# Altium project PM12_CFD.PrjPcb (part 1 of 2)
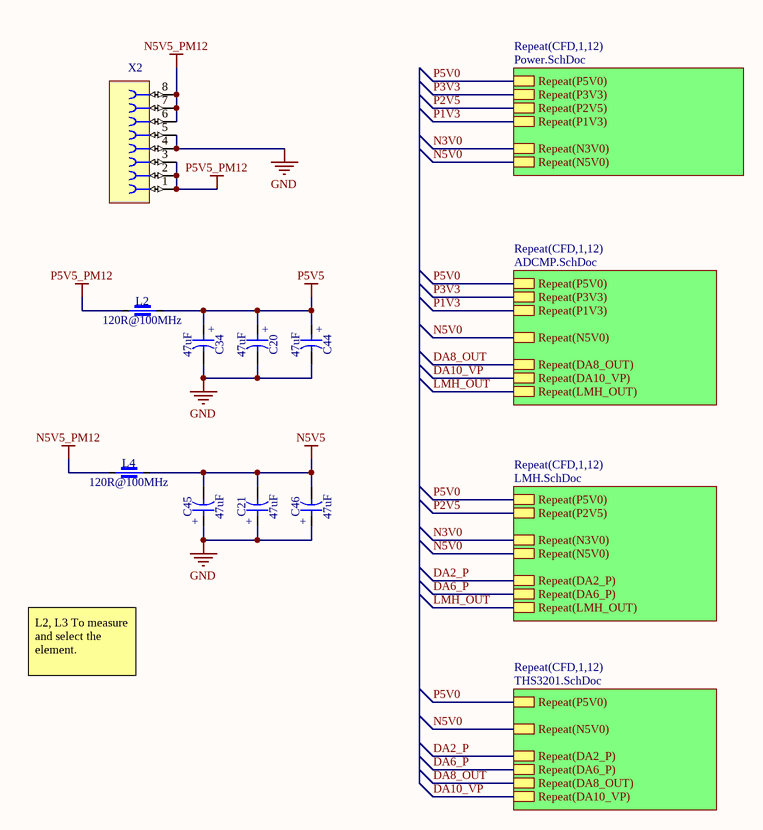
[diagram p0: PM12_CFD_Main.SchDoc]
5 sheets, 1413 parts. Net scope: hierarchical (ports join the sheet entries above them; power ports are global).
Board file: PM12_CFD.PcbDoc
Sheets:
  PM12_CFD_Main.SchDoc
    CFD1 = Power.SchDoc
    CFD2 = Power.SchDoc
    CFD3 = Power.SchDoc
    CFD4 = Power.SchDoc
    CFD5 = Power.SchDoc
    CFD6 = Power.SchDoc
    CFD7 = Power.SchDoc
    CFD8 = Power.SchDoc
    CFD9 = Power.SchDoc
    CFD10 = Power.SchDoc
    CFD11 = Power.SchDoc
    CFD12 = Power.SchDoc
    CFD1 = LMH.SchDoc
    CFD2 = LMH.SchDoc
    CFD3 = LMH.SchDoc
    CFD4 = LMH.SchDoc
    CFD5 = LMH.SchDoc
    CFD6 = LMH.SchDoc
    CFD7 = LMH.SchDoc
    CFD8 = LMH.SchDoc
    CFD9 = LMH.SchDoc
    CFD10 = LMH.SchDoc
    CFD11 = LMH.SchDoc
    CFD12 = LMH.SchDoc
    CFD1 = THS3201.SchDoc
    CFD2 = THS3201.SchDoc
    CFD3 = THS3201.SchDoc
    CFD4 = THS3201.SchDoc
    CFD5 = THS3201.SchDoc
    CFD6 = THS3201.SchDoc
    CFD7 = THS3201.SchDoc
    CFD8 = THS3201.SchDoc
    CFD9 = THS3201.SchDoc
    CFD10 = THS3201.SchDoc
    CFD11 = THS3201.SchDoc
    CFD12 = THS3201.SchDoc
    CFD1 = ADCMP.SchDoc
    CFD2 = ADCMP.SchDoc
    CFD3 = ADCMP.SchDoc
    CFD4 = ADCMP.SchDoc
    CFD5 = ADCMP.SchDoc
    CFD6 = ADCMP.SchDoc
    CFD7 = ADCMP.SchDoc
    CFD8 = ADCMP.SchDoc
    CFD9 = ADCMP.SchDoc
    CFD10 = ADCMP.SchDoc
    CFD11 = ADCMP.SchDoc
    CFD12 = ADCMP.SchDoc

## Sheet PM12_CFD_Main.SchDoc
size A4; SheetNumber: 1; SheetTotal: 5

### Parts
C20  47uF  [CAPAE530X610N]
C21  47uF  [CAPAE530X610N]
C34  47uF  [CAPAE530X610N]
C44  47uF  [CAPAE530X610N]
C45  47uF  [CAPAE530X610N]
C46  47uF  [CAPAE530X610N]
L2  120R@100MHz  [IND_MURATA_BLM31KN]
L4  120R@100MHz  [IND_MURATA_BLM31KN]
X2  Socket 8  [SAMTEC_CES-108-01-T-S]  (value not drawn)

### Sub-sheets
Repeat(CFD,1,12) = Power.SchDoc: Repeat(P5V0), Repeat(P3V3), Repeat(P2V5), Repeat(P1V3), Repeat(N3V0), Repeat(N5V0)
Repeat(CFD,1,12) = LMH.SchDoc: Repeat(LMH_OUT), Repeat(DA2_P), Repeat(DA6_P), Repeat(P5V0), Repeat(P2V5), Repeat(N5V0), Repeat(N3V0)
Repeat(CFD,1,12) = THS3201.SchDoc: Repeat(DA2_P), Repeat(DA6_P), Repeat(DA10_VP), Repeat(P5V0), Repeat(N5V0), Repeat(DA8_OUT)
Repeat(CFD,1,12) = ADCMP.SchDoc: Repeat(LMH_OUT), Repeat(DA10_VP), Repeat(P5V0), Repeat(P3V3), Repeat(P1V3), Repeat(N5V0), Repeat(DA8_OUT)

### Nets
GND: C20.2 C21.1 C34.2 C44.2 C45.1 C46.1 X2.4 X2.5
N5V5: C21.2 C45.2 C46.2 L4.2
N5V5_PM12: L4.1 X2.6 X2.7 X2.8
P5V5: C20.1 C34.1 C44.1 L2.2
P5V5_PM12: L2.1 X2.1 X2.2 X2.3
DA2_P: sheet Repeat(CFD,1,12)/Repeat(DA2_P), sheet Repeat(CFD,1,12)/Repeat(DA2_P)
DA6_P: sheet Repeat(CFD,1,12)/Repeat(DA6_P), sheet Repeat(CFD,1,12)/Repeat(DA6_P)
DA8_OUT: sheet Repeat(CFD,1,12)/Repeat(DA8_OUT), sheet Repeat(CFD,1,12)/Repeat(DA8_OUT)
DA10_VP: sheet Repeat(CFD,1,12)/Repeat(DA10_VP), sheet Repeat(CFD,1,12)/Repeat(DA10_VP)
LMH_OUT: sheet Repeat(CFD,1,12)/Repeat(LMH_OUT), sheet Repeat(CFD,1,12)/Repeat(LMH_OUT)
N3V0: sheet Repeat(CFD,1,12)/Repeat(N3V0), sheet Repeat(CFD,1,12)/Repeat(N3V0)
N5V0: sheet Repeat(CFD,1,12)/Repeat(N5V0), sheet Repeat(CFD,1,12)/Repeat(N5V0), sheet Repeat(CFD,1,12)/Repeat(N5V0), sheet Repeat(CFD,1,12)/Repeat(N5V0)
P1V3: sheet Repeat(CFD,1,12)/Repeat(P1V3), sheet Repeat(CFD,1,12)/Repeat(P1V3)
P2V5: sheet Repeat(CFD,1,12)/Repeat(P2V5), sheet Repeat(CFD,1,12)/Repeat(P2V5)
P3V3: sheet Repeat(CFD,1,12)/Repeat(P3V3), sheet Repeat(CFD,1,12)/Repeat(P3V3)
P5V0: sheet Repeat(CFD,1,12)/Repeat(P5V0), sheet Repeat(CFD,1,12)/Repeat(P5V0), sheet Repeat(CFD,1,12)/Repeat(P5V0), sheet Repeat(CFD,1,12)/Repeat(P5V0)

### Notes on the sheet
- L2, L3 To measure and select the element.
- (in symbol CAE530-610_47UF_16V_20%) +

### Library data of the parts
C20 C21 C34 C44-C46 = CAE530-610_47UF_16V_20%: Polarised capacitor; Part Description: Conductive Polymer Hybrid Aluminum Electrolytic Capacitor; Manufacturer: CHEMI-CON; Manufacturer Part Number: HHXD160ARA470ME61G; Voltage: 16V; Tolerance: ±20%; Part Number: CAE530-610_47UF_16V_20%; Component Kind: Standard; Component Type: Standard; Pin Count: 2; Value: 47uF; Status: Not Recommended; Case: C; Mounted: Yes; Socket: No; SMD: Yes; Sense: No; ComponentHeight: 6.1mm; HelpURL: \\cern.ch\dfs\Applications\Altium\Datasheets\CAE_CHIMI-CON_HXD.pdf; Author: CERN DEM HF; CreateDate: 15.04.2024; LatestRevisionDate: 15.04.2024
L2 L4 = IND1206_MURATA_BLM31KN121SN1: Part Description: SMD Chip Ferrite Bead, BLM31KN_SN Series; Manufacturer: MURATA; Power: 6A; Resistance: 0.009R; Tolerance: ±25%; Part Number: IND1206_MURATA_BLM31KN121SN1; Component Kind: Standard; Component Type: Standard; Footprint: IND_MURATA_BLM31KN1; Pin Count: 2; Value: 120R@100MHz; Manufacturer Part Number: BLM31KN121SN1; Case: 1206; Mounted: Yes; Socket: No; SMD: Yes; Sense: No; ComponentHeight: 1.8mm; HelpURL: \\cern.ch\dfs\Applications\Altium\Datasheets\IND1206_MURATA_ BLM31KN_SN.pdf; Author: CERN DEM HF; CreateDate: 05.01.2022; LatestRevisionDate: 05.01.2022
X2 = SAMTEC_CES-108-01-L-S: Connector 8 Female; Part Description: 8 Contacts, Pitch 2.54mm, Single Row Through Mount Straight Socket (Lead Length 3.25mm); Manufacturer: SAMTEC; PressFit: No; Part Number: SAMTEC_CES-108-01-L-S; Component Kind: Standard; Component Type: Standard; Pin Count: 8; Family: Socket 8; Mounted: Yes; Socket: No; SMD: No; Sense: No; Status: None; Manufacturer Part Number: CES-108-01-L-S; ComponentHeight: 5.08mm; HelpURL: \\cern.ch\dfs\Applications\Altium\Datasheets\SAMTEC_CES-108-01-T-S.pdf; Author: CERN DEM HF; CreateDate: 25.04.2024; LatestRevisionDate: 25.04.2024

## Sheet Power.SchDoc
size A4; SheetNumber: 2; SheetTotal: 5
Used 12 times, as channels CFD1, CFD2, CFD3, CFD4, CFD5, CFD6, CFD7, CFD8, CFD9, CFD10, CFD11, CFD12. Parts and nets are listed once, with the designators drawn on the sheet.
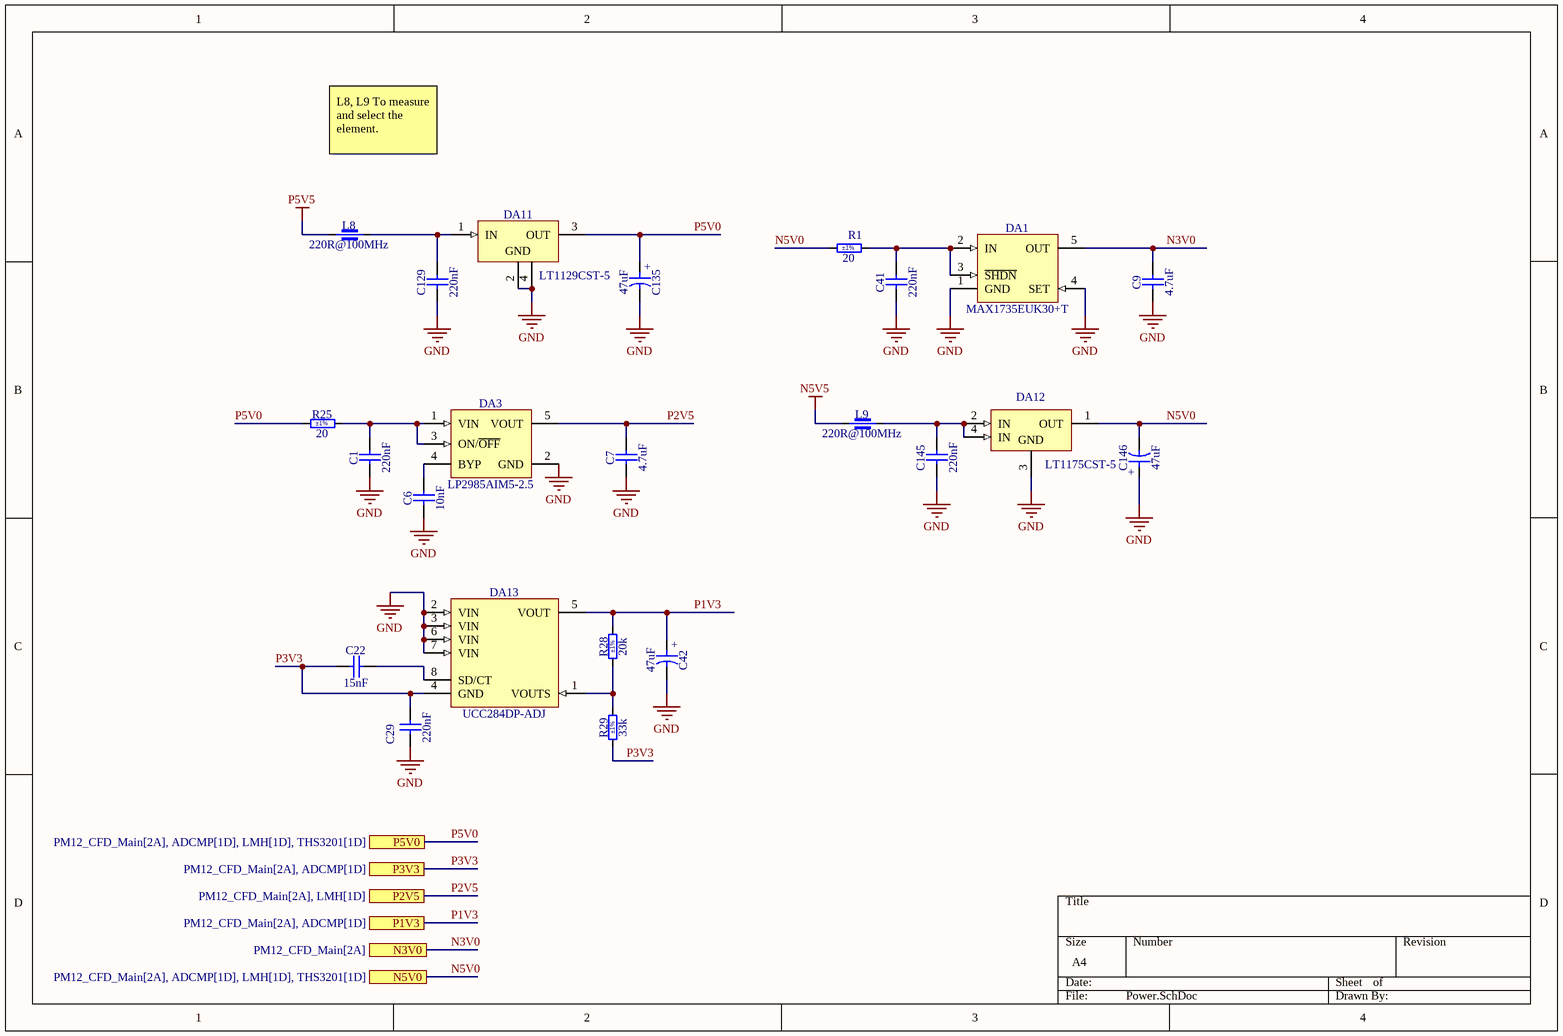
[diagram p1: Power.SchDoc]

### Parts
C1  220nF  [CAPC2012X135N]
C6  10nF  [CAPC2012X135N]
C7  4.7uF  [CAPC2012X135N]
C9  4.7uF  [CAPC2012X135N]
C22  15nF  [CAPC2012X135N]
C29  220nF  [CAPC2012X135N]
C41  220nF  [CAPC2012X135N]
C42  47uF  [CAPAE530X610N]
C129  220nF  [CAPC2012X135N]
C135  47uF  [CAPAE530X610N]
C145  220nF  [CAPC2012X135N]
C146  47uF  [CAPAE530X610N]
DA1  MAX1735EUK30+T  [SOT95P280X145-5N]
DA3  LP2985AIM5-2.5  [SOT95P280X145-5N]
DA11  LT1129CST-5  [SOT230P700X180-4N]
DA12  LT1175CST-5  [SOT230P700X180-4N]
DA13  UCC284DP-ADJ  [SOIC127P600X175-8N]
L8  220R@100MHz  [INDC2012X105N]
L9  220R@100MHz  [INDC2012X105N]
R1  20  Tolerance: ±1%  [RESC2012X60N]
R25  20  Tolerance: ±1%  [RESC2012X60N]
R28  20k  Tolerance: ±1%  [RESC2012X60N]
R29  33k  Tolerance: ±1%  [RESC2012X60N]

### Ports
N3V0 (see PM12_CFD_Main[2A]), N5V0 (see PM12_CFD_Main[2A], ADCMP[1D], LMH[1D], THS3201[1D]), P1V3 (see PM12_CFD_Main[2A], ADCMP[1D]), P2V5 (see PM12_CFD_Main[2A], LMH[1D]), P3V3 (see PM12_CFD_Main[2A], ADCMP[1D]), P5V0 (see PM12_CFD_Main[2A], ADCMP[1D], LMH[1D], THS3201[1D])

### Nets
GND: C1.1 C6.1 C7.1 C9.1 C29.1 C41.1 C42.2 C129.1 C135.2 C145.1 C146.1 DA1.1(GND) DA1.4(SET) DA3.2(GND) DA11.2(GND) DA11.4(GND) DA12.3(GND) DA13.2(VIN) DA13.3(VIN) DA13.6(VIN) DA13.7(VIN)
N5V5: L9.1
P5V5: L8.1
N3V0: C9.2 DA1.5(OUT) ; port N3V0
N5V0: C146.2 DA12.1(OUT) R1.1 ; port N5V0
P1V3: C42.1 DA13.5(VOUT) R28.2 ; port P1V3
P2V5: C7.2 DA3.5(VOUT) ; port P2V5
P3V3: C22.1 C29.2 DA13.4(GND) R29.1 ; port P3V3
P5V0: C135.1 DA11.3(OUT) R25.1 ; port P5V0
NetC1_2: C1.2 DA3.1(VIN) DA3.3(ON/~{OFF}) R25.2
NetC6_2: C6.2 DA3.4(BYP)
NetC22_2: C22.2 DA13.8(SD/CT)
NetC41_2: C41.2 DA1.2(IN) DA1.3(~{SHDN}) R1.2
NetC129_2: C129.2 DA11.1(IN) L8.2
NetC145_2: C145.2 DA12.2(IN) DA12.4(IN) L9.2
NetDA13_1: DA13.1(VOUTS) R28.1 R29.2

### Channels
CFD1: designators end in _CFD1; ports N3V0=N3V0 N5V0=N5V0 P1V3=P1V3 P2V5=P2V5 P3V3=P3V3 P5V0=P5V0
CFD2: designators end in _CFD2; ports N3V0=N3V0 N5V0=N5V0 P1V3=P1V3 P2V5=P2V5 P3V3=P3V3 P5V0=P5V0
CFD3: designators end in _CFD3; ports N3V0=N3V0 N5V0=N5V0 P1V3=P1V3 P2V5=P2V5 P3V3=P3V3 P5V0=P5V0
CFD4: designators end in _CFD4; ports N3V0=N3V0 N5V0=N5V0 P1V3=P1V3 P2V5=P2V5 P3V3=P3V3 P5V0=P5V0
CFD5: designators end in _CFD5; ports N3V0=N3V0 N5V0=N5V0 P1V3=P1V3 P2V5=P2V5 P3V3=P3V3 P5V0=P5V0
CFD6: designators end in _CFD6; ports N3V0=N3V0 N5V0=N5V0 P1V3=P1V3 P2V5=P2V5 P3V3=P3V3 P5V0=P5V0
CFD7: designators end in _CFD7; ports N3V0=N3V0 N5V0=N5V0 P1V3=P1V3 P2V5=P2V5 P3V3=P3V3 P5V0=P5V0
CFD8: designators end in _CFD8; ports N3V0=N3V0 N5V0=N5V0 P1V3=P1V3 P2V5=P2V5 P3V3=P3V3 P5V0=P5V0
CFD9: designators end in _CFD9; ports N3V0=N3V0 N5V0=N5V0 P1V3=P1V3 P2V5=P2V5 P3V3=P3V3 P5V0=P5V0
CFD10: designators end in _CFD10; ports N3V0=N3V0 N5V0=N5V0 P1V3=P1V3 P2V5=P2V5 P3V3=P3V3 P5V0=P5V0
CFD11: designators end in _CFD11; ports N3V0=N3V0 N5V0=N5V0 P1V3=P1V3 P2V5=P2V5 P3V3=P3V3 P5V0=P5V0
CFD12: designators end in _CFD12; ports N3V0=N3V0 N5V0=N5V0 P1V3=P1V3 P2V5=P2V5 P3V3=P3V3 P5V0=P5V0

### Notes on the sheet
- L8, L9 To measure and select the element.
- (in symbol CAE530-610_47UF_16V_20%) +

### Library data of the parts
C1 C29 C41 C129 C145 = CC0805_220NF_50V_10%_X7R: Non-polarised capacitor; Part Description: SMD Multilayer Chip Ceramic Capacitor; Manufacturer: GENERIC; Manufacturer1 Part Number: GRM21BR71H224KA01L; Voltage: 50V; TC: X7R; Tolerance: ±10%; Part Number: CC0805_220NF_50V_10%_X7R; Component Kind: Standard; Component Type: Standard; Pin Count: 2; Value: 220nF; Status: Preferred; Manufacturer Part Number: CC0805_220NF_50V_10%_X7R; Case: 0805; Mounted: Yes; Socket: No; SMD: Yes; Sense: No; Manufacturer1 Example: MURATA; Manufacturer1 ComponentHeight: 1.35mm; HelpURL: \\cern.ch\dfs\Applications\Altium\Datasheets\CC0805_X7R_MURATA.pdf; Author: CERN DEM JLC; CreateDate: 03.12.2007; LatestRevisionDate: 03.12.2007
C6 = CC0805_10NF_50V_5%_C0G: Non-polarised capacitor; Part Description: SMD Multilayer Chip Ceramic Capacitor; Manufacturer: GENERIC; Manufacturer1 Part Number: C0805C103J5GACTU; Voltage: 50V; TC: C0G/NP0; Tolerance: ±5%; Part Number: CC0805_10NF_50V_5%_C0G; Component Kind: Standard; Component Type: Standard; Pin Count: 2; Value: 10nF; Status: None; Manufacturer Part Number: CC0805_10NF_50V_5%_C0G; Case: 0805; Mounted: Yes; Socket: No; SMD: Yes; Sense: No; Manufacturer1 Example: KEMET; Manufacturer1 ComponentHeight: 0.88mm; HelpURL: \\cern.ch\dfs\Applications\Altium\Datasheets\CC0805_C0G_KEMET_(Commercial Grade).pdf; Author: CERN DEM JLC; CreateDate: 02.02.2011; LatestRevisionDate: 22.04.2015
C7 C9 = CC0805_4.7UF_16V_10%_X7R: Non-polarised capacitor; Part Description: SMD Multilayer Chip Ceramic Capacitor; Manufacturer: GENERIC; Manufacturer1 Part Number: EMK212B7475KG-T; Voltage: 16V; TC: X7R; Tolerance: ±10%; Part Number: CC0805_4.7UF_16V_10%_X7R; Component Kind: Standard; Component Type: Standard; Pin Count: 2; Value: 4.7uF; Status: Preferred; Manufacturer Part Number: CC0805_4.7UF_16V_10%_X7R; Case: 0805; Mounted: Yes; Socket: No; SMD: Yes; Sense: No; Manufacturer1 Example: TAIYO YUDEN; Manufacturer1 ComponentHeight: 1.35mm; HelpURL: \\cern.ch\dfs\Applications\Altium\Datasheets\CC0805_X7R_TAIYO-YUDEN_HIGH-VALUE.pdf; Author: CERN DEM JLC; CreateDate: 16.09.2014; LatestRevisionDate: 16.09.2014
C22 = CC0805_15NF_50V_10%_X7R: Non-polarised capacitor; Part Description: SMD Multilayer Chip Ceramic Capacitor; Manufacturer: GENERIC; Manufacturer1 Part Number: 223858615638; Voltage: 50V; TC: X7R; Tolerance: ±10%; Part Number: CC0805_15NF_50V_10%_X7R; Component Kind: Standard; Component Type: Standard; Pin Count: 2; Value: 15nF; Status: Preferred; Manufacturer Part Number: CC0805_15NF_50V_10%_X7R; Case: 0805; Mounted: Yes; Socket: No; SMD: Yes; Sense: No; Manufacturer1 Example: PHYCOMP; Manufacturer1 ComponentHeight: 1.35mm; HelpURL: \\cern.ch\dfs\Applications\Altium\Datasheets\CC0805_X7R_PHYCOMP.pdf; Author: CERN DEM JLC; CreateDate: 03.12.2007; LatestRevisionDate: 03.12.2007
C42 C135 C146 = CAE530-610_47UF_16V_20%: as C20 on sheet PM12_CFD_Main; Part Number: CAE530-610_47UF_16V_20%; Component Kind: Standard; Component Type: Standard; Pin Count: 2; Value: 47uF; Status: Not Recommended; Case: C; Mounted: Yes; Socket: No; SMD: Yes; Sense: No; ComponentHeight: 6.1mm; HelpURL: \\cern.ch\dfs\Applications\Altium\Datasheets\CAE_CHIMI-CON_HXD.pdf; Author: CERN DEM HF; CreateDate: 15.04.2024; LatestRevisionDate: 15.04.2024
DA1 = MAX1735EUK30+T: 200mA, Negative-Output, Low-Dropout Linear Regulator; Part Description: 3V, 200mA, Negative-Output, Low-Dropout Linear Regulator; Manufacturer: MAXIM; PressFit: No; Bonding: No; Part Number: MAX1735EUK30+T; Component Kind: Standard; Component Type: Standard; Device: MAX1735EUK30+T; PackageDescription: SOT23, 0.95mm Pitch; 5 Pin, 1.60mm W X 2.90mm L X 1.45mm H body, IPC Medium Density; Manufacturer Part Number: MAX1735EUK30; Pin Count: 5; Case: SOT23-5; Mounted: Yes; Socket: No; SMD: Yes; Sense: No; ComponentHeight: 1.45mm; HelpURL: \\cern.ch\dfs\Applications\Altium\Datasheets\MAX1735EUK30+T.pdf; Author: CERN DEM JLC; CreateDate: 17.02.2010; LatestRevisionDate: 04.04.2022
DA3 = LP2985AIM5-2.5: 150mA Low-Noise Low-Dropout Regulator Whit Shutdown; Part Description: 2.5V, 150mA Low-Noise Low-Dropout Regulator Whit Shutdown; Manufacturer: TEXAS INSTRUMENTS; PressFit: No; Bonding: No; Part Number: LP2985AIM5-2.5; Component Kind: Standard; Component Type: Standard; Device: LP2985AIM5-2.5; PackageDescription: SOT23, 0.95mm Pitch; 5 Pin, 1.60mm W X 2.90mm L X 1.45mm H body, IPC Medium Density; Manufacturer Part Number: LP2985AIM5-2.5; Pin Count: 5; Case: SOT23-5; Mounted: Yes; Socket: No; SMD: Yes; Sense: No; ComponentHeight: 1.45mm; HelpURL: \\cern.ch\dfs\Applications\Altium\Datasheets\LP2985AIM5.pdf; Author: CERN DEM HF; CreateDate: 16.04.2024; LatestRevisionDate: 16.04.2024
DA11 = LT1129CST-5: 3-Terminal Regulator 1=IN 2=GND 3=OUT 4=GND; Part Description: 5V, 700mA Micropower Low Dropout Regulator with Shutdown; Manufacturer: LINEAR TECHNOLOGY; PressFit: No; Bonding: No; Part Number: LT1129CST-5; Component Kind: Standard; Component Type: Standard; Device: LT1129CST-5; PackageDescription: SOT223, 2.30mm Pitch; 4 Pin, 3.70mm W X 6.70mm L X 1.80mm H body, IPC Medium Density; Manufacturer Part Number: LT1129CST-5; Pin Count: 4; Case: SOT223; Mounted: Yes; Socket: No; SMD: Yes; Sense: No; ComponentHeight: 1.8mm; HelpURL: \\cern.ch\dfs\Applications\Altium\Datasheets\LT1129.pdf; Author: CERN DEM HF; CreateDate: 16.04.2024; LatestRevisionDate: 16.04.2024
DA12 = LT1175CST-5: 3-Terminal Regulator 1=OUT 2=IN 3=GND 4=IN; Part Description: 5V 500mA Negative Low Dropout Micropower Regulator; Manufacturer: LINEAR TECHNOLOGY; PressFit: No; Bonding: No; Part Number: LT1175CST-5; Component Kind: Standard; Component Type: Standard; Device: LT1175CST-5; PackageDescription: SOT223, 2.30mm Pitch; 4 Pin, 3.70mm W X 6.70mm L X 1.80mm H body, IPC Medium Density; Manufacturer Part Number: LT1175CST-5; Pin Count: 4; Case: SOT223; Mounted: Yes; Socket: No; SMD: Yes; Sense: No; ComponentHeight: 1.8mm; HelpURL: \\cern.ch\dfs\Applications\Altium\Datasheets\LT1175.pdf; Author: CERN DEM HF; CreateDate: 16.04.2024; LatestRevisionDate: 16.04.2024
DA13 = UCC284DP-ADJ: 5V, 500mA Low-Dropout Negative Linear Regulator; Part Description: 5V, 500mA Low-Dropout Negative Linear Regulator, Adjustable Output; Manufacturer: TEXAS INSTRUMENTS; PressFit: No; Bonding: No; Part Number: UCC284DP-ADJ; Component Kind: Standard; Component Type: Standard; Device: UCC284DP-ADJ; PackageDescription: SOIC 8, Pitch 1.27mm, Body 4x5mm, IPC Medium Density; Manufacturer Part Number: UCC284DP-ADJ; Pin Count: 8; Case: SOIC8; Mounted: Yes; Socket: No; SMD: Yes; Sense: No; ComponentHeight: 1.75mm; HelpURL: \\cern.ch\dfs\Applications\Altium\Datasheets\UCC284DP-ADJ.pdf; Author: CERN DEM BR; CreateDate: 20.06.2019; LatestRevisionDate: 20.06.2019
L8 L9 = IND0805_TDK_MPZ2012S221A: Part Description: SMT Chip Bead for General Power Line (MPZ Series); Manufacturer: TDK; Power: 3A; Resistance: 0.04R; Tolerance: ±25%; Part Number: IND0805_TDK_MPZ2012S221A; Component Kind: Standard; Component Type: Standard; Pin Count: 2; Value: 220R@100MHz; Manufacturer Part Number: MPZ2012S221A; Case: 0805; Mounted: Yes; Socket: No; SMD: Yes; Sense: No; ComponentHeight: 1.05mm; HelpURL: \\cern.ch\dfs\Applications\Altium\Datasheets\IND0805_TDK_MPZ2012.pdf; Author: CERN DEM HF; CreateDate: 04.10.2021; LatestRevisionDate: 04.10.2021
R1 R25 = R0805_20R_1%_0.125W_100PPM: Resistor - 1%; Part Description: General Purpose Thick Film Chip Resistor; Manufacturer: GENERIC; Manufacturer1 Part Number: NRC10F20R0TRF; Power: 0.125W; TC: ±100ppm/°C; PressFit: No; Part Number: R0805_20R_1%_0.125W_100PPM; Component Kind: Standard; Component Type: Standard; Pin Count: 2; Value: 20; Status: Preferred; Manufacturer Part Number: R0805_20R_1%_0.125W_100PPM; Case: 0805; Mounted: Yes; Sense: No; Socket: No; SMD: Yes; Manufacturer1 Example: NIC COMPONENT; Manufacturer1 ComponentHeight: 0.6mm; HelpURL: \\cern.ch\dfs\Applications\Altium\Datasheets\R0805_NIC_NRC.pdf; Author: CERN DEM JLC; CreateDate: 03.12.2007; LatestRevisionDate: 13.03.2008
R28 = R0805_20K_1%_0.125W_100PPM: Resistor - 1%; Part Description: General Purpose Thick Film Chip Resistor; Manufacturer: GENERIC; Manufacturer1 Part Number: NRC10F2002TRF; Power: 0.125W; TC: ±100ppm/°C; PressFit: No; Part Number: R0805_20K_1%_0.125W_100PPM; Component Kind: Standard; Component Type: Standard; Pin Count: 2; Value: 20k; Status: Preferred; Manufacturer Part Number: R0805_20K_1%_0.125W_100PPM; Case: 0805; Mounted: Yes; Sense: No; Socket: No; SMD: Yes; Manufacturer1 Example: NIC COMPONENT; Manufacturer1 ComponentHeight: 0.6mm; HelpURL: \\cern.ch\dfs\Applications\Altium\Datasheets\R0805_NIC_NRC.pdf; Author: CERN DEM JLC; CreateDate: 03.12.2007; LatestRevisionDate: 13.03.2008
R29 = R0805_33K_1%_0.125W_100PPM: Resistor - 1%; Part Description: General Purpose Thick Film Chip Resistor; Manufacturer: GENERIC; Manufacturer1 Part Number: NRC10F3302TRF; Power: 0.125W; TC: ±100ppm/°C; PressFit: No; Part Number: R0805_33K_1%_0.125W_100PPM; Component Kind: Standard; Component Type: Standard; Pin Count: 2; Value: 33k; Status: Preferred; Manufacturer Part Number: R0805_33K_1%_0.125W_100PPM; Case: 0805; Mounted: Yes; Sense: No; Socket: No; SMD: Yes; Manufacturer1 Example: NIC COMPONENT; Manufacturer1 ComponentHeight: 0.6mm; HelpURL: \\cern.ch\dfs\Applications\Altium\Datasheets\R0805_NIC_NRC.pdf; Author: CERN DEM JLC; CreateDate: 03.12.2007; LatestRevisionDate: 13.03.2008

## Sheet LMH.SchDoc
size A4; SheetNumber: 3; SheetTotal: 5
Used 12 times, as channels CFD1, CFD2, CFD3, CFD4, CFD5, CFD6, CFD7, CFD8, CFD9, CFD10, CFD11, CFD12. Parts and nets are listed once, with the designators drawn on the sheet.
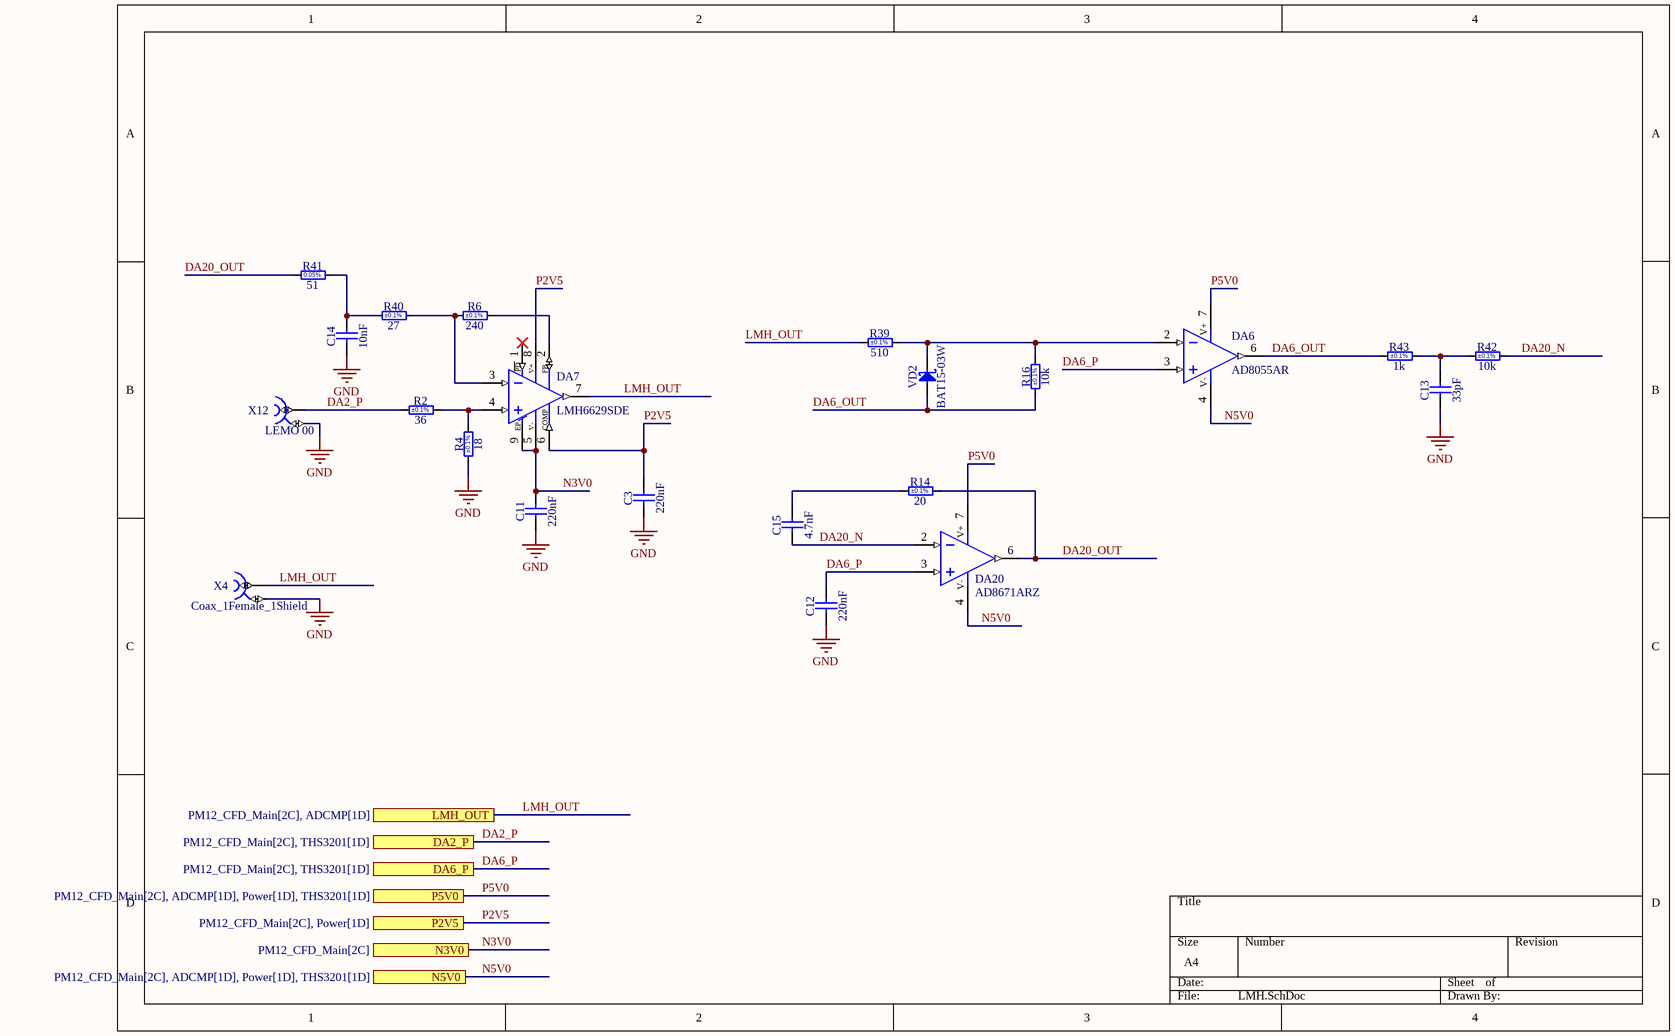
[diagram p2: LMH.SchDoc]

### Parts
C3  220nF  [CAPC2012X135N]
C11  220nF  [CAPC2012X135N]
C12  220nF  [CAPC2012X135N]
C13  33pF  [CAPC2013X115N]
C14  10nF  [CAPC2012X135N]
C15  4.7nF  [CAPC2012X135N]
DA6  AD8055AR  [SOIC127P600X175-8N]
DA7  LMH6629SDE  [TEXAS_NGQ0008A]
DA20  AD8671ARZ  [SOIC127P600X175-8N]
R2  36  Tolerance: ±0.1%  [RESC1608X64N]
R4  18  Tolerance: ±0.1%  [RESC1608X64N]
R6  240  Tolerance: ±0.1%  [RESC1005X40N]
R14  20  Tolerance: ±0.1%  [RESC2012X60N]
R16  10k  Tolerance: ±0.1%  [RESC2012X60N]
R39  510  Tolerance: ±0.1%  [RESC1005X40N]
R40  27  Tolerance: ±0.1%  [RESC1608X64N]
R41  51  [RESC2012X60N]
R42  10k  Tolerance: ±0.1%  [RESC2012X60N]
R43  1k  Tolerance: ±0.1%  [RESC2012X60N]
VD2  BAT15-03W  [SOD2512X110N]
X4  Coax_1Female_1Shield  [SAMTEC_MMCX-J-P-H-ST-TH1]
X12  LEMO 00  [LEMO_EPL.00.250.NTN]

### Ports
DA2_P (see PM12_CFD_Main[2C], THS3201[1D]), DA6_P (see PM12_CFD_Main[2C], THS3201[1D]), LMH_OUT (see PM12_CFD_Main[2C], ADCMP[1D]), N3V0 (see PM12_CFD_Main[2C]), N5V0 (see PM12_CFD_Main[2C], ADCMP[1D], Power[1D], THS3201[1D]), P2V5 (see PM12_CFD_Main[2C], Power[1D]), P5V0 (see PM12_CFD_Main[2C], ADCMP[1D], Power[1D], THS3201[1D])

### Nets
GND: C3.1 C11.1 C12.1 C13.1 C14.1 R4.1 X4.2 X12.2
DA2_P: R2.1 X12.1 ; port DA2_P
DA6_OUT: DA6.6(OUT) R16.1 R43.1 VD2.2(A)
DA6_P: C12.2 DA6.3(IN+) DA20.3(IN+) ; port DA6_P
DA20_N: C15.1 DA20.2(IN-) R42.2
DA20_OUT: DA20.6(OUT) R14.2 R41.1
LMH_OUT: DA7.7(OUT) R39.1 X4.1 ; port LMH_OUT
N3V0: C11.2 DA7.5(V-) DA7.9(EP) ; port N3V0
N5V0: DA6.4(V-) DA20.4(V-) ; port N5V0
P2V5: C3.2 DA7.6(COMP) DA7.8(V+) ; port P2V5
P5V0: DA6.7(V+) DA20.7(V+) ; port P5V0
NetC13_2: C13.2 R42.1 R43.2
NetC14_2: C14.2 R40.1 R41.2
NetC15_2: C15.2 R14.1
NetDA6_2: DA6.2(IN-) R16.2 R39.2 VD2.1(C)
NetDA7_2: DA7.2(FB) R6.2
NetDA7_3: DA7.3(IN-) R6.1 R40.2
NetDA7_4: DA7.4(IN+) R2.2 R4.2

Not connected (* = marked no-connect by the designer): DA7 1(~{PD})*

### Channels
CFD1: designators end in _CFD1; ports DA2_P=DA2_P DA6_P=DA6_P LMH_OUT=LMH_OUT N3V0=N3V0 N5V0=N5V0 P2V5=P2V5 P5V0=P5V0
CFD2: designators end in _CFD2; ports DA2_P=DA2_P DA6_P=DA6_P LMH_OUT=LMH_OUT N3V0=N3V0 N5V0=N5V0 P2V5=P2V5 P5V0=P5V0
CFD3: designators end in _CFD3; ports DA2_P=DA2_P DA6_P=DA6_P LMH_OUT=LMH_OUT N3V0=N3V0 N5V0=N5V0 P2V5=P2V5 P5V0=P5V0
CFD4: designators end in _CFD4; ports DA2_P=DA2_P DA6_P=DA6_P LMH_OUT=LMH_OUT N3V0=N3V0 N5V0=N5V0 P2V5=P2V5 P5V0=P5V0
CFD5: designators end in _CFD5; ports DA2_P=DA2_P DA6_P=DA6_P LMH_OUT=LMH_OUT N3V0=N3V0 N5V0=N5V0 P2V5=P2V5 P5V0=P5V0
CFD6: designators end in _CFD6; ports DA2_P=DA2_P DA6_P=DA6_P LMH_OUT=LMH_OUT N3V0=N3V0 N5V0=N5V0 P2V5=P2V5 P5V0=P5V0
CFD7: designators end in _CFD7; ports DA2_P=DA2_P DA6_P=DA6_P LMH_OUT=LMH_OUT N3V0=N3V0 N5V0=N5V0 P2V5=P2V5 P5V0=P5V0
CFD8: designators end in _CFD8; ports DA2_P=DA2_P DA6_P=DA6_P LMH_OUT=LMH_OUT N3V0=N3V0 N5V0=N5V0 P2V5=P2V5 P5V0=P5V0
CFD9: designators end in _CFD9; ports DA2_P=DA2_P DA6_P=DA6_P LMH_OUT=LMH_OUT N3V0=N3V0 N5V0=N5V0 P2V5=P2V5 P5V0=P5V0
CFD10: designators end in _CFD10; ports DA2_P=DA2_P DA6_P=DA6_P LMH_OUT=LMH_OUT N3V0=N3V0 N5V0=N5V0 P2V5=P2V5 P5V0=P5V0
CFD11: designators end in _CFD11; ports DA2_P=DA2_P DA6_P=DA6_P LMH_OUT=LMH_OUT N3V0=N3V0 N5V0=N5V0 P2V5=P2V5 P5V0=P5V0
CFD12: designators end in _CFD12; ports DA2_P=DA2_P DA6_P=DA6_P LMH_OUT=LMH_OUT N3V0=N3V0 N5V0=N5V0 P2V5=P2V5 P5V0=P5V0

### Notes on the sheet
- (in symbol LMH6629SDE) PD
- (in symbol R0805_51R_0.05%_0.125W_10PPM) 0.05%

### Library data of the parts
C3 C11 C12 = CC0805_220NF_50V_10%_X7R: as C1 on sheet Power; Part Number: CC0805_220NF_50V_10%_X7R; Component Kind: Standard; Component Type: Standard; Pin Count: 2; Value: 220nF; Status: Preferred; Manufacturer Part Number: CC0805_220NF_50V_10%_X7R; Case: 0805; Mounted: Yes; Socket: No; SMD: Yes; Sense: No; Manufacturer1 Example: MURATA; Manufacturer1 ComponentHeight: 1.35mm; HelpURL: \\cern.ch\dfs\Applications\Altium\Datasheets\CC0805_X7R_MURATA.pdf; Author: CERN DEM JLC; CreateDate: 03.12.2007; LatestRevisionDate: 03.12.2007
C13 = CC0805_33PF_200V_1%_NP0: Non-polarised capacitor; Part Description: SMD Multilayer Chip Ceramic Capacitor; Manufacturer: GENERIC; Manufacturer1 Part Number: KGQ21HCG2D330FT; Voltage: 200V; TC: C0G/NP0; Tolerance: ±1%; Part Number: CC0805_33PF_200V_1%_NP0; Component Kind: Standard; Component Type: Standard; Pin Count: 2; Value: 33pF; Status: None; Manufacturer Part Number: CC0805_33PF_200V_1%_NP0; Case: 0805; Mounted: Yes; Socket: No; SMD: Yes; Sense: No; Manufacturer1 Example: AVX; Manufacturer1 ComponentHeight: 1.15mm; HelpURL: \\cern.ch\dfs\Applications\Altium\Datasheets\CC0805_NP0_AVX_KGQ.pdf; Author: CERN DEM HF; CreateDate: 15.04.2024; LatestRevisionDate: 15.04.2024
C14 = CC0805_10NF_50V_2%_C0G: Non-polarised capacitor; Part Description: SMD Multilayer Chip Ceramic Capacitor; Manufacturer: GENERIC; Manufacturer1 Part Number: 0805N103G500CT; Voltage: 50V; TC: C0G/NP0; Tolerance: ±2%; Part Number: CC0805_10NF_50V_2%_C0G; Component Kind: Standard; Component Type: Standard; Pin Count: 2; Value: 10nF; Status: None; Manufacturer Part Number: CC0805_10NF_50V_2%_C0G; Case: 0805; Mounted: Yes; Socket: No; SMD: Yes; Sense: No; Manufacturer1 Example: Walsin Technology Corporation; Manufacturer1 ComponentHeight: 1.35mm; HelpURL: \\cern.ch\dfs\Applications\Altium\Datasheets\CC0805_C0G_Walsin.pdf; Author: CERN DEM HF; CreateDate: 15.04.2024; LatestRevisionDate: 15.04.2024
C15 = CC0805_4.7NF_250V_1%_NP0: Non-polarised capacitor; Part Description: SMD Multilayer Chip Ceramic Capacitor; Manufacturer: GENERIC; Manufacturer Part Number: CC0805_4.7NF_250V_1%_X7R; Manufacturer1 Part Number: GCM21B5C2E472FX01L; Voltage: 250V; TC: NP0; Tolerance: ±1%; Part Number: CC0805_4.7NF_250V_1%_NP0; Component Kind: Standard; Component Type: Standard; Pin Count: 2; Value: 4.7nF; Status: None; Case: 0805; Mounted: Yes; Socket: No; SMD: Yes; Sense: No; Manufacturer1 Example: MURATA; Manufacturer1 ComponentHeight: 1.45mm; HelpURL: \\cern.ch\dfs\Applications\Altium\Datasheets\CC0805_MURATA_GCM21B5C2E472FX01L.pdf; Author: CERN DEM HF; CreateDate: 15.04.2024; LatestRevisionDate: 15.04.2024
DA6 = AD8055AR: Operational Amplifier; Part Description: Low Cost, 300 MHz Voltage Feedback Amplifier; Manufacturer: ANALOG DEVICES; PressFit: No; Bonding: No; Part Number: AD8055AR; Component Kind: Standard; Component Type: Standard; Device: AD8055AR; PackageDescription: SOIC 8, Pitch 1.27mm - Body 4x5mm, IPC Medium Density; Manufacturer Part Number: AD8055AR; Pin Count: 8; Case: SOIC8; Mounted: Yes; Socket: No; SMD: Yes; Sense: No; ComponentHeight: 1.75mm; Author: CERN DEM HF; HelpURL: \\cern.ch\dfs\Applications\Altium\Datasheets\AD8055.pdf; CreateDate: 15.04.2024; LatestRevisionDate: 15.04.2024
DA7 = LMH6629SDE: Ultra-Low Noise, High-Speed Operational Amplifier with Shutdown; Manufacturer: TEXAS INSTRUMENTS; PressFit: No; Bonding: No; Part Number: LMH6629SDE; Component Kind: Standard; Component Type: Standard; Device: LMH6629SDE; PackageDescription: TEXAS Case Style NGQ(WSON-N9), SON, 0.50mm Pitch, Square; 8 Pin, 3.00mm L X 3.00mm W X 0.80mm H body (w/Thermal Tab 1.70 X 2.10mm); Part Description: Ultra-Low Noise, High-Speed Operational Amplifier with Shutdown; Manufacturer Part Number: LMH6629SDE; Pin Count: 9; Case: SON8; Mounted: Yes; Socket: No; SMD: Yes; Sense: No; ComponentHeight: 0.8mm; Author: CERN DEM HF; HelpURL: \\cern.ch\dfs\Applications\Altium\Datasheets\LMH6629.pdf; CreateDate: 12.06.2023; LatestRevisionDate: 12.06.2023
DA20 = AD8671ARZ: Operational Amplifier; Part Description: Precision, Very Low Noise, Low Input Bias Current Operational Amplifier; Manufacturer: ANALOG DEVICES; PressFit: No; Bonding: No; Part Number: AD8671ARZ; Component Kind: Standard; Component Type: Standard; Device: AD8671ARZ; PackageDescription: SOIC 8, Pitch 1.27mm - Body 4x5mm, IPC Medium Density; Manufacturer Part Number: AD8671AR; Pin Count: 8; Case: SOIC8; Mounted: Yes; Socket: No; SMD: Yes; Sense: No; ComponentHeight: 1.75mm; Author: CERN DEM JLC; HelpURL: \\cern.ch\dfs\Applications\Altium\Datasheets\AD8671ARZ.pdf; CreateDate: 17.06.2014; LatestRevisionDate: 31.03.2022
R2 = R0603_36R_0.1%_0.1W_10PPM: Resistor - 0.1%; Part Description: Thin Film Chip Resistor; Manufacturer: GENERIC; Manufacturer1 Part Number: RT0603BRC0736RL; Power: 0.1W; TC: ±10ppm/°C; PressFit: No; Part Number: R0603_36R_0.1%_0.1W_10PPM; Component Kind: Standard; Component Type: Standard; Pin Count: 2; Value: 36; Status: Not Recommended; Manufacturer Part Number: R0603_36R_0.1%_0.1W_10PPM; Case: 0603; Mounted: Yes; Sense: No; Socket: No; SMD: Yes; Manufacturer1 Example: YAGEO; Manufacturer1 ComponentHeight: 0.55mm; HelpURL: \\cern.ch\dfs\Applications\Altium\Datasheets\R0603_YAGEO_RT.pdf; Author: CERN DEM HF; CreateDate: 25.04.2024; LatestRevisionDate: 25.04.2024
R4 = R0603_18R_0.1%_0.1W_25PPM: Resistor - 0.1%; Part Description: Thin Film Chip Resistor; Manufacturer: GENERIC; Manufacturer1 Part Number: RT0603BRD0718RL; Power: 0.1W; TC: ±25ppm/°C; PressFit: No; Part Number: R0603_18R_0.1%_0.1W_25PPM; Component Kind: Standard; Component Type: Standard; Pin Count: 2; Value: 18; Status: Not Recommended; Manufacturer Part Number: R0603_18R_0.1%_0.1W_25PPM; Case: 0603; Mounted: Yes; Sense: No; Socket: No; SMD: Yes; Manufacturer1 Example: YAGEO; Manufacturer1 ComponentHeight: 0.55mm; HelpURL: \\cern.ch\dfs\Applications\Altium\Datasheets\R0603_YAGEO_RT.pdf; Author: CERN DEM HF; CreateDate: 25.04.2024; LatestRevisionDate: 25.04.2024
R6 = R0402_240R_0.1%_0.0625W_10PPM: Resistor - 0.1%; Part Description: Thick Film Chip Resistor; Manufacturer: GENERIC; Manufacturer1 Part Number: ERA2ARB241X; Power: 0.063W; TC: ±10ppm/°C; PressFit: No; Part Number: R0402_240R_0.1%_0.0625W_10PPM; Component Kind: Standard; Component Type: Standard; Pin Count: 2; Value: 240; Status: Not Recommended; Manufacturer Part Number: R0402_240R_0.1%_0.0625W_10PPM; Case: 0402; Mounted: Yes; Sense: No; Socket: No; SMD: Yes; Manufacturer1 Example: PANASONIC; Manufacturer1 ComponentHeight: 0.4mm; HelpURL: \\cern.ch\dfs\Applications\Altium\Datasheets\R0402_PANASONIC_ERA.pdf; Author: CERN DEM HF; CreateDate: 25.04.2024; LatestRevisionDate: 25.04.2024
R14 = R0805_20R_0.1%_0.1W_10PPM: Resistor - 0.1%; Part Description: Thin Film Chip Resistor; Manufacturer: GENERIC; Manufacturer1 Part Number: RN73C2A20RBTG; Power: 0.1W; TC: ±10ppm; PressFit: No; Part Number: R0805_20R_0.1%_0.1W_10PPM; Component Kind: Standard; Component Type: Standard; Pin Count: 2; Value: 20; Status: Not Recommended; Manufacturer Part Number: R0805_20R_0.1%_0.1W_10PPM; Case: 0805; Mounted: Yes; Sense: No; Socket: No; SMD: Yes; Manufacturer1 Example: TYCO HOLSWORTHY; Manufacturer1 ComponentHeight: 0.6mm; HelpURL: \\cern.ch\dfs\Applications\Altium\Datasheets\R0805_Tyco_RN73.pdf; Author: CERN DEM JLC; CreateDate: 03.12.2007; LatestRevisionDate: 13.03.2008
R16 R42 = R0805_10K_0.1%_0.1W_10PPM: Resistor - 0.1%; Part Description: Thin Film Chip Resistor; Manufacturer: GENERIC; Manufacturer1 Part Number: RN73C2A10KBTG; Power: 0.1W; TC: ±10ppm; PressFit: No; Part Number: R0805_10K_0.1%_0.1W_10PPM; Component Kind: Standard; Component Type: Standard; Pin Count: 2; Value: 10k; Status: Not Recommended; Manufacturer Part Number: R0805_10K_0.1%_0.1W_10PPM; Case: 0805; Mounted: Yes; Sense: No; Socket: No; SMD: Yes; Manufacturer1 Example: TYCO HOLSWORTHY; Manufacturer1 ComponentHeight: 0.6mm; HelpURL: \\cern.ch\dfs\Applications\Altium\Datasheets\R0805_Tyco_RN73.pdf; Author: CERN DEM JLC; CreateDate: 03.12.2007; LatestRevisionDate: 13.03.2008
R39 = R0402_510R_0.1%_0.0625W_10PPM: Resistor - 0.1%; Part Description: Thick Film Chip Resistor; Manufacturer: GENERIC; Manufacturer1 Part Number: ERA2ARB511X; Power: 0.063W; TC: ±10ppm/°C; PressFit: No; Part Number: R0402_510R_0.1%_0.0625W_10PPM; Component Kind: Standard; Component Type: Standard; Pin Count: 2; Value: 510; Status: Not Recommended; Manufacturer Part Number: R0402_510R_0.1%_0.0625W_10PPM; Case: 0402; Mounted: Yes; Sense: No; Socket: No; SMD: Yes; Manufacturer1 Example: PANASONIC; Manufacturer1 ComponentHeight: 0.4mm; HelpURL: \\cern.ch\dfs\Applications\Altium\Datasheets\R0402_PANASONIC_ERA.pdf; Author: CERN DEM HF; CreateDate: 25.04.2024; LatestRevisionDate: 25.04.2024
R40 = R0603_27R_0.1%_0.1W_10PPM: Resistor - 0.1%; Part Description: Thin Film Chip Resistor; Manufacturer: GENERIC; Manufacturer1 Part Number: RT0603BRB0727RL; Power: 0.1W; TC: ±10ppm/°C; PressFit: No; Part Number: R0603_27R_0.1%_0.1W_10PPM; Component Kind: Standard; Component Type: Standard; Pin Count: 2; Value: 27; Status: Not Recommended; Manufacturer Part Number: R0603_27R_0.1%_0.1W_10PPM; Case: 0603; Mounted: Yes; Sense: No; Socket: No; SMD: Yes; Manufacturer1 Example: YAGEO; Manufacturer1 ComponentHeight: 0.55mm; HelpURL: \\cern.ch\dfs\Applications\Altium\Datasheets\R0603_YAGEO_RT.pdf; Author: CERN DEM HF; CreateDate: 25.04.2024; LatestRevisionDate: 25.04.2024
R41 = R0805_51R_0.05%_0.125W_10PPM: Resistor - 0.05%; Part Description: Thin Film Chip Resistor; Manufacturer: GENERIC; Manufacturer1 Part Number: RG2012N-510-W-T1; Power: 0.1W; TC: ±10ppm/°C; Tolerance: ±0.1%; PressFit: No; Part Number: R0805_51R_0.05%_0.125W_10PPM; Component Kind: Standard; Component Type: Standard; Pin Count: 2; Value: 51; Status: Not Recommended; Manufacturer Part Number: R0805_51R_0.05%_0.125W_10PPM; Case: 0805; Mounted: Yes; Sense: No; Socket: No; SMD: Yes; Manufacturer1 Example: SUSUMU; Manufacturer1 ComponentHeight: 0.5mm; HelpURL: \\cern.ch\dfs\Applications\Altium\Datasheets\R0805_SUSUMU_RG.pdf; Author: CERN DEM HF; CreateDate: 25.04.2024; LatestRevisionDate: 25.04.2024
R43 = R0805_1K_0.1%_0.1W_10PPM: Resistor - 0.1%; Part Description: Thin Film Chip Resistor; Manufacturer: GENERIC; Manufacturer1 Part Number: RN73C2A1K0BTG; Power: 0.1W; TC: ±10ppm; PressFit: No; Part Number: R0805_1K_0.1%_0.1W_10PPM; Component Kind: Standard; Component Type: Standard; Pin Count: 2; Value: 1k; Status: Not Recommended; Manufacturer Part Number: R0805_1K_0.1%_0.1W_10PPM; Case: 0805; Mounted: Yes; Sense: No; Socket: No; SMD: Yes; Manufacturer1 Example: TYCO HOLSWORTHY; Manufacturer1 ComponentHeight: 0.6mm; HelpURL: \\cern.ch\dfs\Applications\Altium\Datasheets\R0805_TYCO_RN73.pdf; Author: CERN DEM JLC; CreateDate: 28.05.2013; LatestRevisionDate: 28.05.2013
VD2 = BAT15-03W: Schottky Diode; Part Description: Single Silicon RF Schottky Diode; Manufacturer: INFINEON; Device: BAT60A; Voltage: 4V; Power: 100mA; PressFit: No; Bonding: No; Part Number: BAT15-03W; Component Kind: Standard; Component Type: Standard; PackageDescription: Small Outline Diode (SOD-323), 1.70mm W X 1.25mm L X 1.10mm H body,  IPC Medium Density; Manufacturer Part Number: BAT15-03W; Pin Count: 2; Case: SOD-323; Mounted: Yes; Socket: No; SMD: Yes; Sense: No; ComponentHeight: 1.1mm; HelpURL: \\cern.ch\dfs\Applications\Altium\Datasheets\BAT15-03W.pdf; Author: CERN DEM HF; CreateDate: 15.04.2024; LatestRevisionDate: 15.04.2024
X4 = SAMTEC_MMCX-J-P-H-ST-TH1: Part Description: Straight Through-hole 50 Ohms Micro Mini RF Jack, MMCX Series; Manufacturer: SAMTEC; PressFit: No; Part Number: SAMTEC_MMCX-J-P-H-ST-TH1; Component Kind: Standard; Component Type: Standard; Pin Count: 2; Mounted: Yes; Socket: No; SMD: No; Sense: No; Status: None; Manufacturer Part Number: MMCX-J-P-H-ST-TH1; ComponentHeight: 4.35mm; HelpURL: \\cern.ch\dfs\Applications\Altium\Datasheets\SAMTEC_MMCX-J-P-H-ST-TH1.pdf; Author: CERN DEM JLC; CreateDate: 05.12.2012; LatestRevisionDate: 05.12.2012
X12 = LEMO_EPL.00.250.NTN: Part Description: Size 00, 50 Ohms Coaxial Elbow (90°) socket; PressFit: No; Part Number: LEMO_EPL.00.250.NTN; Component Kind: Standard; Component Type: Standard; Pin Count: 2; Family: LEMO 00; Mounted: Yes; Socket: No; SMD: No; Sense: No; Status: Obsolete; Manufacturer: LEMO; Manufacturer Part Number: EPL.00.250.NTN; ComponentHeight: 7mm; HelpURL: \\cern.ch\dfs\Applications\Altium\Datasheets\LEMO_EPL.00.250.NTN.pdf; Author: CERN DEM JLC; CreateDate: 03.12.2007; LatestRevisionDate: 11.02.2016

## Sheet THS3201.SchDoc
size A4; SheetNumber: 5; SheetTotal: 5
Used 12 times, as channels CFD1, CFD2, CFD3, CFD4, CFD5, CFD6, CFD7, CFD8, CFD9, CFD10, CFD11, CFD12. Parts and nets are listed once, with the designators drawn on the sheet.
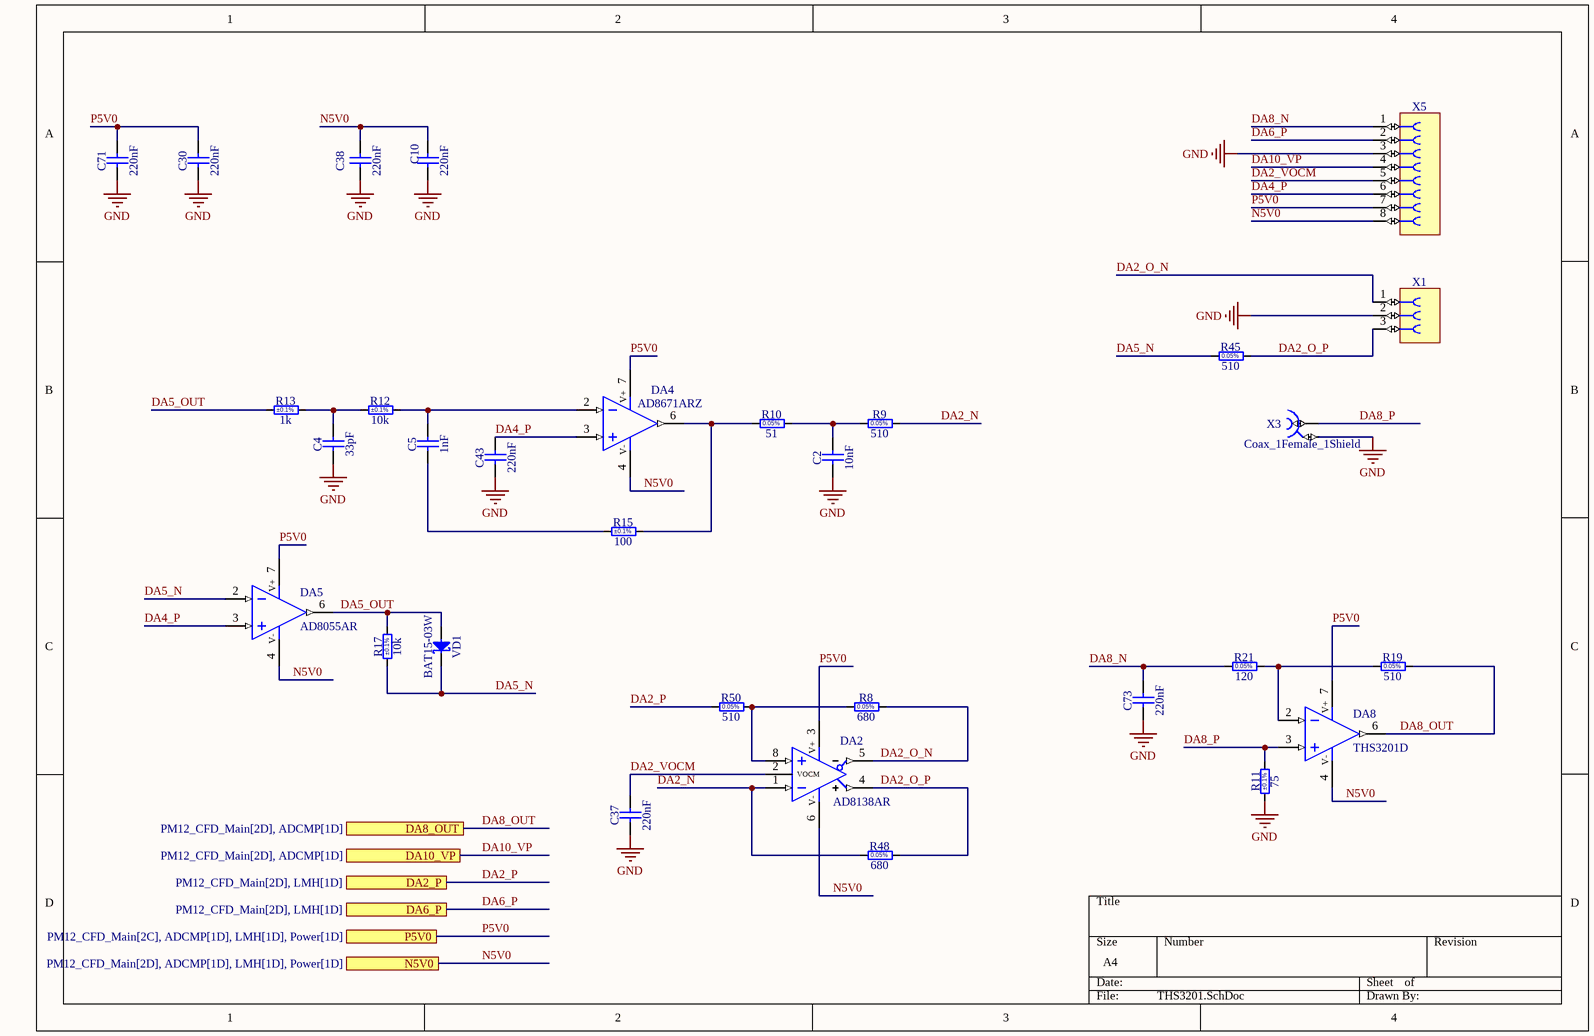
[diagram p3: THS3201.SchDoc]

### Parts
C2  10nF  [CAPC2012X135N]
C4  33pF  [CAPC2013X115N]
C5  1nF  [CAPC2013X100N]
C10  220nF  [CAPC2012X135N]
C30  220nF  [CAPC2012X135N]
C37  220nF  [CAPC2012X135N]
C38  220nF  [CAPC2012X135N]
C43  220nF  [CAPC2012X135N]
C71  220nF  [CAPC2012X135N]
C73  220nF  [CAPC2012X135N]
DA2  AD8138AR  [SOIC127P600X175-8N]
DA4  AD8671ARZ  [SOIC127P600X175-8N]
DA5  AD8055AR  [SOIC127P600X175-8N]
DA8  THS3201D  [SOIC127P600X175-8N]
R8  680  [RESC2012X60N]
R9  510  [RESC1608X55N]
R10  51  [RESC2012X60N]
R11  75  Tolerance: ±0.1%  [RESC1608X55N]
R12  10k  Tolerance: ±0.1%  [RESC2012X60N]
R13  1k  Tolerance: ±0.1%  [RESC2012X60N]
R15  100  Tolerance: ±0.1%  [RESC2012X60N]
R17  10k  Tolerance: ±0.1%  [RESC2012X60N]
R19  510  [RESC1608X55N]
R21  120  [RESC1608X55N]
R45  510  [RESC1608X55N]
R48  680  [RESC2012X60N]
R50  510  [RESC1608X55N]
VD1  BAT15-03W  [SOD2512X110N]
X1  Socket 3  [SAMTEC_CES-103-01-T-S]  (value not drawn)
X3  Coax_1Female_1Shield  [SAMTEC_MMCX-J-P-H-ST-TH1]
X5  Socket 8  [SAMTEC_CES-108-01-T-S]  (value not drawn)

### Ports
DA2_P (see PM12_CFD_Main[2D], LMH[1D]), DA6_P (see PM12_CFD_Main[2D], LMH[1D]), DA8_OUT (see PM12_CFD_Main[2D], ADCMP[1D]), DA10_VP (see PM12_CFD_Main[2D], ADCMP[1D]), N5V0 (see PM12_CFD_Main[2D], ADCMP[1D], LMH[1D], Power[1D]), P5V0 (see PM12_CFD_Main[2C], ADCMP[1D], LMH[1D], Power[1D])

### Nets
GND: C2.1 C4.1 C10.1 C30.1 C37.1 C38.1 C43.1 C71.1 C73.1 R11.1 X1.2 X3.2 X5.3
DA2_N: DA2.1(IN-) R9.2 R48.1
DA2_O_N: DA2.5(VOUT-) R8.2 X1.1
DA2_O_P: DA2.4(VOUT+) R45.2 R48.2 X1.3
DA2_P: R50.1 ; port DA2_P
DA2_VOCM: C37.2 DA2.2(VOCM) X5.5
DA4_P: C43.2 DA4.3(IN+) DA5.3(IN+) X5.6
DA5_N: DA5.2(IN-) R17.1 R45.1 VD1.1(C)
DA5_OUT: DA5.6(OUT) R13.1 R17.2 VD1.2(A)
DA6_P: X5.2 ; port DA6_P
DA8_N: C73.2 R21.1 X5.1
DA8_OUT: DA8.6(OUT) R19.2 ; port DA8_OUT
DA8_P: DA8.3(IN+) R11.2 X3.1
DA10_VP: X5.4 ; port DA10_VP
N5V0: C10.2 C38.2 DA2.6(V-) DA4.4(V-) DA5.4(V-) DA8.4(V-) X5.8 ; port N5V0
P5V0: C30.2 C71.2 DA2.3(V+) DA4.7(V+) DA5.7(V+) DA8.7(V+) X5.7 ; port P5V0
NetC2_2: C2.2 R9.1 R10.2
NetC4_2: C4.2 R12.1 R13.2
NetC5_1: C5.1 R15.1
NetC5_2: C5.2 DA4.2(IN-) R12.2
NetDA2_8: DA2.8(IN+) R8.1 R50.2
NetDA4_6: DA4.6(OUT) R10.1 R15.2
NetDA8_2: DA8.2(IN-) R19.1 R21.2

### Channels
CFD1: designators end in _CFD1; ports DA2_P=DA2_P DA6_P=DA6_P DA8_OUT=DA8_OUT DA10_VP=DA10_VP N5V0=N5V0 P5V0=P5V0
CFD2: designators end in _CFD2; ports DA2_P=DA2_P DA6_P=DA6_P DA8_OUT=DA8_OUT DA10_VP=DA10_VP N5V0=N5V0 P5V0=P5V0
CFD3: designators end in _CFD3; ports DA2_P=DA2_P DA6_P=DA6_P DA8_OUT=DA8_OUT DA10_VP=DA10_VP N5V0=N5V0 P5V0=P5V0
CFD4: designators end in _CFD4; ports DA2_P=DA2_P DA6_P=DA6_P DA8_OUT=DA8_OUT DA10_VP=DA10_VP N5V0=N5V0 P5V0=P5V0
CFD5: designators end in _CFD5; ports DA2_P=DA2_P DA6_P=DA6_P DA8_OUT=DA8_OUT DA10_VP=DA10_VP N5V0=N5V0 P5V0=P5V0
CFD6: designators end in _CFD6; ports DA2_P=DA2_P DA6_P=DA6_P DA8_OUT=DA8_OUT DA10_VP=DA10_VP N5V0=N5V0 P5V0=P5V0
CFD7: designators end in _CFD7; ports DA2_P=DA2_P DA6_P=DA6_P DA8_OUT=DA8_OUT DA10_VP=DA10_VP N5V0=N5V0 P5V0=P5V0
CFD8: designators end in _CFD8; ports DA2_P=DA2_P DA6_P=DA6_P DA8_OUT=DA8_OUT DA10_VP=DA10_VP N5V0=N5V0 P5V0=P5V0
CFD9: designators end in _CFD9; ports DA2_P=DA2_P DA6_P=DA6_P DA8_OUT=DA8_OUT DA10_VP=DA10_VP N5V0=N5V0 P5V0=P5V0
CFD10: designators end in _CFD10; ports DA2_P=DA2_P DA6_P=DA6_P DA8_OUT=DA8_OUT DA10_VP=DA10_VP N5V0=N5V0 P5V0=P5V0
CFD11: designators end in _CFD11; ports DA2_P=DA2_P DA6_P=DA6_P DA8_OUT=DA8_OUT DA10_VP=DA10_VP N5V0=N5V0 P5V0=P5V0
CFD12: designators end in _CFD12; ports DA2_P=DA2_P DA6_P=DA6_P DA8_OUT=DA8_OUT DA10_VP=DA10_VP N5V0=N5V0 P5V0=P5V0

### Notes on the sheet
- (in symbol R0603_120R_0.05%_0.1W_10PPM) 0.05%
- (in symbol R0603_510R_0.1%_0.1W_10PPM) 0.05%
- (in symbol R0805_51R_0.05%_0.125W_10PPM) 0.05%
- (in symbol R0805_680R_0.05%_0.125W_10PPM) 0.05%

### Library data of the parts
C2 = CC0805_10NF_50V_2%_C0G: as C14 on sheet LMH; Part Number: CC0805_10NF_50V_2%_C0G; Component Kind: Standard; Component Type: Standard; Pin Count: 2; Value: 10nF; Status: None; Manufacturer Part Number: CC0805_10NF_50V_2%_C0G; Case: 0805; Mounted: Yes; Socket: No; SMD: Yes; Sense: No; Manufacturer1 Example: Walsin Technology Corporation; Manufacturer1 ComponentHeight: 1.35mm; HelpURL: \\cern.ch\dfs\Applications\Altium\Datasheets\CC0805_C0G_Walsin.pdf; Author: CERN DEM HF; CreateDate: 15.04.2024; LatestRevisionDate: 15.04.2024
C4 = CC0805_33PF_200V_1%_NP0: as C13 on sheet LMH; Part Number: CC0805_33PF_200V_1%_NP0; Component Kind: Standard; Component Type: Standard; Pin Count: 2; Value: 33pF; Status: None; Manufacturer Part Number: CC0805_33PF_200V_1%_NP0; Case: 0805; Mounted: Yes; Socket: No; SMD: Yes; Sense: No; Manufacturer1 Example: AVX; Manufacturer1 ComponentHeight: 1.15mm; HelpURL: \\cern.ch\dfs\Applications\Altium\Datasheets\CC0805_NP0_AVX_KGQ.pdf; Author: CERN DEM HF; CreateDate: 15.04.2024; LatestRevisionDate: 15.04.2024
C5 = CC0805_1NF_25V_1%_C0G: Non-polarised capacitor; Part Description: SMD Multilayer Chip Ceramic Capacitor; Manufacturer: GENERIC; Manufacturer1 Part Number: C0805C102F3GACTU; Voltage: 25V; TC: C0G/NP0; Tolerance: ±1%; Part Number: CC0805_1NF_25V_1%_C0G; Component Kind: Standard; Component Type: Standard; Pin Count: 2; Value: 1nF; Status: None; Manufacturer Part Number: CC0805_1NF_25V_1%_C0G; Case: 0805; Mounted: Yes; Socket: No; SMD: Yes; Sense: No; Manufacturer1 Example: KEMET; Manufacturer1 ComponentHeight: 0.88mm; HelpURL: \\cern.ch\dfs\Applications\Altium\Datasheets\CC0805_C0G_KEMET_(Commercial Grade).pdf; Author: CERN DEM JLC; CreateDate: 11.03.2015; LatestRevisionDate: 11.03.2015
C10 C30 C37 C38 C43 C71 C73 = CC0805_220NF_50V_10%_X7R: as C1 on sheet Power; Part Number: CC0805_220NF_50V_10%_X7R; Component Kind: Standard; Component Type: Standard; Pin Count: 2; Value: 220nF; Status: Preferred; Manufacturer Part Number: CC0805_220NF_50V_10%_X7R; Case: 0805; Mounted: Yes; Socket: No; SMD: Yes; Sense: No; Manufacturer1 Example: MURATA; Manufacturer1 ComponentHeight: 1.35mm; HelpURL: \\cern.ch\dfs\Applications\Altium\Datasheets\CC0805_X7R_MURATA.pdf; Author: CERN DEM JLC; CreateDate: 03.12.2007; LatestRevisionDate: 03.12.2007
DA2 = AD8138AR: Differential Amplifier; Part Description: Low Distortion Differential ADC Driver; Manufacturer: ANALOG DEVICES; PressFit: No; Bonding: No; Part Number: AD8138AR; Component Kind: Standard; Component Type: Standard; Device: AD8138AR; PackageDescription: SOIC 8, Pitch 1.27mm - Body 4x5mm, IPC Medium Density; Status: Not recommended; Manufacturer Part Number: AD8138AR; Pin Count: 7; Case: SOIC8; Mounted: Yes; Socket: No; SMD: Yes; Sense: No; ComponentHeight: 1.75mm; Author: CERN DEM JLC; HelpURL: \\cern.ch\dfs\Applications\Altium\Datasheets\AD8138AR.pdf; CreateDate: 24.11.2008; LatestRevisionDate: 24.11.2008
DA4 = AD8671ARZ: as DA20 on sheet LMH; Part Number: AD8671ARZ; Component Kind: Standard; Component Type: Standard; Device: AD8671ARZ; PackageDescription: SOIC 8, Pitch 1.27mm - Body 4x5mm, IPC Medium Density; Manufacturer Part Number: AD8671AR; Pin Count: 8; Case: SOIC8; Mounted: Yes; Socket: No; SMD: Yes; Sense: No; ComponentHeight: 1.75mm; Author: CERN DEM JLC; HelpURL: \\cern.ch\dfs\Applications\Altium\Datasheets\AD8671ARZ.pdf; CreateDate: 17.06.2014; LatestRevisionDate: 31.03.2022
DA5 = AD8055AR: as DA6 on sheet LMH; Part Number: AD8055AR; Component Kind: Standard; Component Type: Standard; Device: AD8055AR; PackageDescription: SOIC 8, Pitch 1.27mm - Body 4x5mm, IPC Medium Density; Manufacturer Part Number: AD8055AR; Pin Count: 8; Case: SOIC8; Mounted: Yes; Socket: No; SMD: Yes; Sense: No; ComponentHeight: 1.75mm; Author: CERN DEM HF; HelpURL: \\cern.ch\dfs\Applications\Altium\Datasheets\AD8055.pdf; CreateDate: 15.04.2024; LatestRevisionDate: 15.04.2024
DA8 = THS3201D: Operational Amplifier; Part Description: 1.8GHz, Low Distorsion, Current-Feedback Amplifier; Manufacturer: TEXAS INSTRUMENTS; PressFit: No; Bonding: No; Status Comment: Not Recommended for New Design; Part Number: THS3201D; Component Kind: Standard; Component Type: Standard; Device: THS3201D; PackageDescription: SOIC 8, Pitch 1.27mm - Body 4x5mm, IPC Medium Density; Status: Not Recommended; Manufacturer Part Number: THS3201D; Pin Count: 9; Case: SOIC8; Mounted: Yes; Socket: No; SMD: Yes; Sense: No; ComponentHeight: 1.1mm; Author: CERN DEM HF; HelpURL: \\cern.ch\dfs\Applications\Altium\Datasheets\THS3201.pdf; CreateDate: 06.05.2024; LatestRevisionDate: 06.05.2024
R8 R48 = R0805_680R_0.05%_0.125W_10PPM: Resistor - 0.05%; Part Description: Thin Film Chip Resistor; Manufacturer: GENERIC; Manufacturer1 Part Number: RG2012N-681-W-T1; Power: 0.1W; TC: ±10ppm/°C; Tolerance: ±0.1%; PressFit: No; Part Number: R0805_680R_0.05%_0.125W_10PPM; Component Kind: Standard; Component Type: Standard; Pin Count: 2; Value: 680; Status: Not Recommended; Manufacturer Part Number: R0805_680R_0.05%_0.125W_10PPM; Case: 0805; Mounted: Yes; Sense: No; Socket: No; SMD: Yes; Manufacturer1 Example: SUSUMU; Manufacturer1 ComponentHeight: 0.5mm; HelpURL: \\cern.ch\dfs\Applications\Altium\Datasheets\R0805_SUSUMU_RG.pdf; Author: CERN DEM HF; CreateDate: 25.04.2024; LatestRevisionDate: 25.04.2024
R9 R19 R45 R50 = R0603_510R_0.1%_0.1W_10PPM: Resistor - 0.05%; Part Description: Thin Film Chip Resistor; Manufacturer: GENERIC; Manufacturer1 Part Number: RG1608N-511-W-T1; Power: 0.1W; TC: ±10ppm/°C; Tolerance: ±0.1%; PressFit: No; Part Number: R0603_510R_0.1%_0.1W_10PPM; Component Kind: Standard; Component Type: Standard; Pin Count: 2; Value: 510; Status: Not Recommended; Manufacturer Part Number: R0603_510R_0.1%_0.1W_10PPM; Case: 0805; Mounted: Yes; Sense: No; Socket: No; SMD: Yes; Manufacturer1 Example: SUSUMU; Manufacturer1 ComponentHeight: 0.5mm; HelpURL: \\cern.ch\dfs\Applications\Altium\Datasheets\R0603_SUSUMU_RG.pdf; Author: CERN DEM HF; CreateDate: 25.04.2024; LatestRevisionDate: 25.04.2024
R10 = R0805_51R_0.05%_0.125W_10PPM: as R41 on sheet LMH; Part Number: R0805_51R_0.05%_0.125W_10PPM; Component Kind: Standard; Component Type: Standard; Pin Count: 2; Value: 51; Status: Not Recommended; Manufacturer Part Number: R0805_51R_0.05%_0.125W_10PPM; Case: 0805; Mounted: Yes; Sense: No; Socket: No; SMD: Yes; Manufacturer1 Example: SUSUMU; Manufacturer1 ComponentHeight: 0.5mm; HelpURL: \\cern.ch\dfs\Applications\Altium\Datasheets\R0805_SUSUMU_RG.pdf; Author: CERN DEM HF; CreateDate: 25.04.2024; LatestRevisionDate: 25.04.2024
R11 = R0603_75R_0.1%_0.063W_10PPM: Resistor - 0.1%; Part Description: Thin Film Chip Resistor; Manufacturer: GENERIC; Manufacturer1 Part Number: RN73C1J75RBTDF; Power: 0.063W; TC: ±10ppm; PressFit: No; Part Number: R0603_75R_0.1%_0.063W_10PPM; Component Kind: Standard; Component Type: Standard; Pin Count: 2; Value: 75; Status: Not Recommended; Manufacturer Part Number: R0603_75R_0.1%_0.063W_10PPM; Case: 0603; Mounted: Yes; Sense: No; Socket: No; SMD: Yes; Manufacturer1 Example: TYCO HOLSWORTHY; Manufacturer1 ComponentHeight: 0.5mm; HelpURL: \\cern.ch\dfs\Applications\Altium\Datasheets\R0603_Tyco_RN73.pdf; Author: CERN DEM JLC; CreateDate: 03.12.2007; LatestRevisionDate: 13.03.2008
R12 R17 = R0805_10K_0.1%_0.1W_10PPM: as R16 on sheet LMH; Part Number: R0805_10K_0.1%_0.1W_10PPM; Component Kind: Standard; Component Type: Standard; Pin Count: 2; Value: 10k; Status: Not Recommended; Manufacturer Part Number: R0805_10K_0.1%_0.1W_10PPM; Case: 0805; Mounted: Yes; Sense: No; Socket: No; SMD: Yes; Manufacturer1 Example: TYCO HOLSWORTHY; Manufacturer1 ComponentHeight: 0.6mm; HelpURL: \\cern.ch\dfs\Applications\Altium\Datasheets\R0805_Tyco_RN73.pdf; Author: CERN DEM JLC; CreateDate: 03.12.2007; LatestRevisionDate: 13.03.2008
R13 = R0805_1K_0.1%_0.1W_10PPM: as R43 on sheet LMH; Part Number: R0805_1K_0.1%_0.1W_10PPM; Component Kind: Standard; Component Type: Standard; Pin Count: 2; Value: 1k; Status: Not Recommended; Manufacturer Part Number: R0805_1K_0.1%_0.1W_10PPM; Case: 0805; Mounted: Yes; Sense: No; Socket: No; SMD: Yes; Manufacturer1 Example: TYCO HOLSWORTHY; Manufacturer1 ComponentHeight: 0.6mm; HelpURL: \\cern.ch\dfs\Applications\Altium\Datasheets\R0805_TYCO_RN73.pdf; Author: CERN DEM JLC; CreateDate: 28.05.2013; LatestRevisionDate: 28.05.2013
R15 = R0805_100R_0.1%_0.1W_10PPM: Resistor - 0.1%; Part Description: Thin Film Chip Resistor; Manufacturer: GENERIC; Manufacturer1 Part Number: RN73C2A100RBTG; Power: 0.1W; TC: ±10ppm; PressFit: No; Part Number: R0805_100R_0.1%_0.1W_10PPM; Component Kind: Standard; Component Type: Standard; Pin Count: 2; Value: 100; Status: Not Recommended; Manufacturer Part Number: R0805_100R_0.1%_0.1W_10PPM; Case: 0805; Mounted: Yes; Sense: No; Socket: No; SMD: Yes; Manufacturer1 Example: TYCO HOLSWORTHY; Manufacturer1 ComponentHeight: 0.6mm; HelpURL: \\cern.ch\dfs\Applications\Altium\Datasheets\R0805_Tyco_RN73.pdf; Author: CERN DEM JLC; CreateDate: 03.12.2007; LatestRevisionDate: 13.03.2008
R21 = R0603_120R_0.05%_0.1W_10PPM: Resistor - 0.05%; Part Description: Thin Film Chip Resistor; Manufacturer: GENERIC; Manufacturer1 Part Number: RG1608N-121-W-T1; Power: 0.1W; TC: ±10ppm/°C; PressFit: No; Part Number: R0603_120R_0.05%_0.1W_10PPM; Component Kind: Standard; Component Type: Standard; Pin Count: 2; Value: 120; Status: Not Recommended; Tolerance: ±0.05%; Manufacturer Part Number: R0603_120R_0.05%_0.1W_10PPM; Case: 0805; Mounted: Yes; Sense: No; Socket: No; SMD: Yes; Manufacturer1 Example: SUSUMU; Manufacturer1 ComponentHeight: 0.5mm; HelpURL: \\cern.ch\dfs\Applications\Altium\Datasheets\R0603_SUSUMU_RG.pdf; Author: CERN DEM HF; CreateDate: 25.04.2024; LatestRevisionDate: 25.04.2024
VD1 = BAT15-03W: as VD2 on sheet LMH; Part Number: BAT15-03W; Component Kind: Standard; Component Type: Standard; PackageDescription: Small Outline Diode (SOD-323), 1.70mm W X 1.25mm L X 1.10mm H body,  IPC Medium Density; Manufacturer Part Number: BAT15-03W; Pin Count: 2; Case: SOD-323; Mounted: Yes; Socket: No; SMD: Yes; Sense: No; ComponentHeight: 1.1mm; HelpURL: \\cern.ch\dfs\Applications\Altium\Datasheets\BAT15-03W.pdf; Author: CERN DEM HF; CreateDate: 15.04.2024; LatestRevisionDate: 15.04.2024
X1 = SAMTEC_CES-103-01-L-S: Connector 3 Female; Part Description: 3 Contacts, Pitch 2.54mm, Single Row Through Mount Straight Socket (Lead Length 3.25mm); Manufacturer: SAMTEC; PressFit: No; Part Number: SAMTEC_CES-103-01-L-S; Component Kind: Standard; Component Type: Standard; Pin Count: 3; Family: Socket 3; Mounted: Yes; Socket: No; SMD: No; Sense: No; Status: None; Manufacturer Part Number: CES-103-01-L-S; ComponentHeight: 5.08mm; HelpURL: \\cern.ch\dfs\Applications\Altium\Datasheets\SAMTEC_CES-103-01-T-S.pdf; Author: CERN DEM HF; CreateDate: 25.04.2024; LatestRevisionDate: 25.04.2024
X3 = SAMTEC_MMCX-J-P-H-ST-TH1: as X4 on sheet LMH; Part Number: SAMTEC_MMCX-J-P-H-ST-TH1; Component Kind: Standard; Component Type: Standard; Pin Count: 2; Mounted: Yes; Socket: No; SMD: No; Sense: No; Status: None; Manufacturer Part Number: MMCX-J-P-H-ST-TH1; ComponentHeight: 4.35mm; HelpURL: \\cern.ch\dfs\Applications\Altium\Datasheets\SAMTEC_MMCX-J-P-H-ST-TH1.pdf; Author: CERN DEM JLC; CreateDate: 05.12.2012; LatestRevisionDate: 05.12.2012
X5 = SAMTEC_CES-108-01-L-S: as X2 on sheet PM12_CFD_Main; Part Number: SAMTEC_CES-108-01-L-S; Component Kind: Standard; Component Type: Standard; Pin Count: 8; Family: Socket 8; Mounted: Yes; Socket: No; SMD: No; Sense: No; Status: None; Manufacturer Part Number: CES-108-01-L-S; ComponentHeight: 5.08mm; HelpURL: \\cern.ch\dfs\Applications\Altium\Datasheets\SAMTEC_CES-108-01-T-S.pdf; Author: CERN DEM HF; CreateDate: 25.04.2024; LatestRevisionDate: 25.04.2024